# EAGLE design 18066^0 (EAGLE 7.6.0)
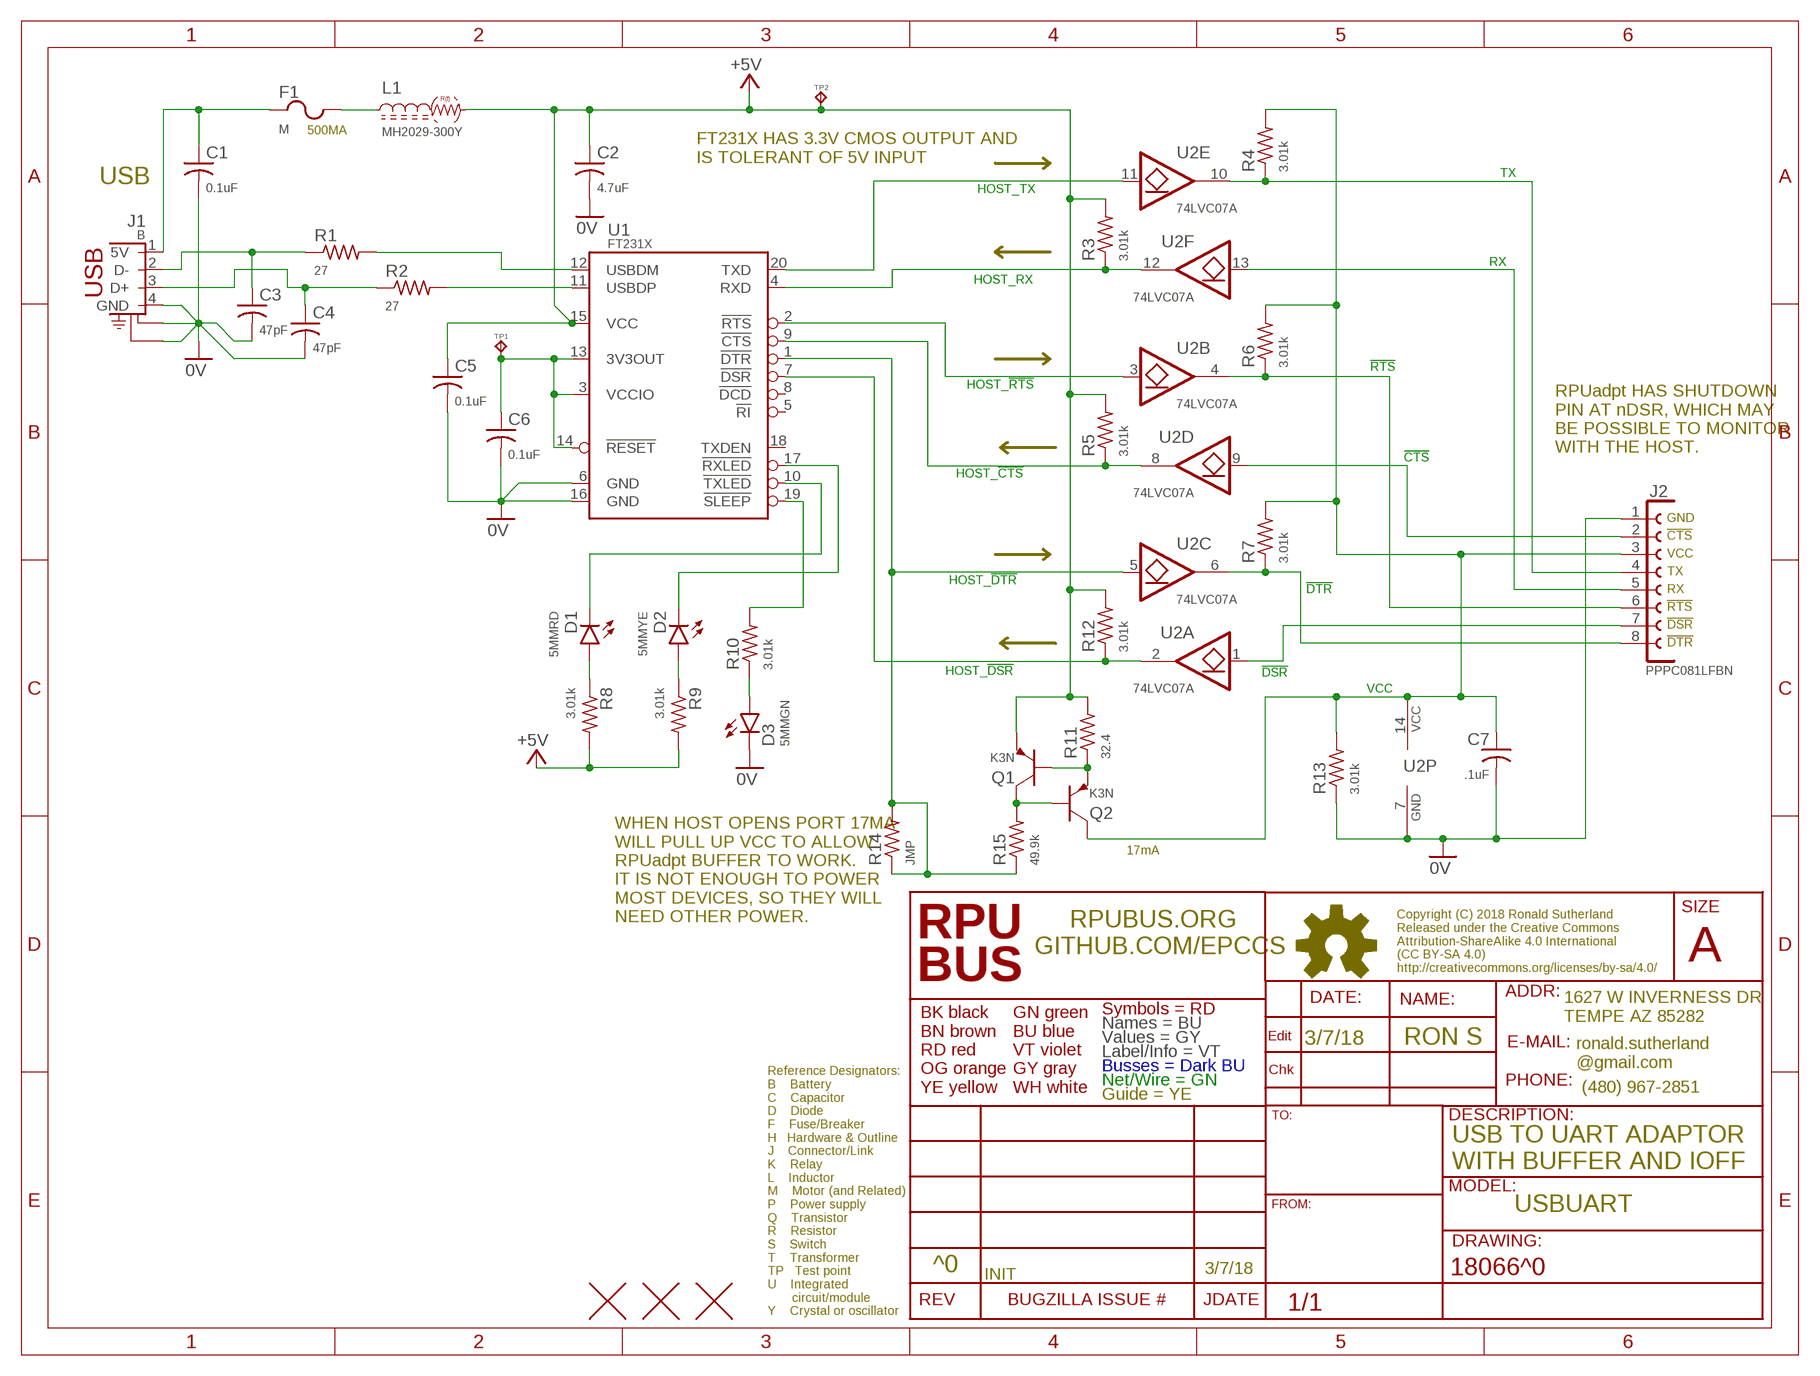
[diagram p0: schematic, sheet 1]

## Parts
C1  0.1uF  CC0603A  [C0603(1608)]
C2  4.7uF  CC1206  [C1206(3216)]
C3  47pF  CC0603A  [C0603(1608)]
C4  47pF  CC0603A  [C0603(1608)]
C5  0.1uF  CC0603A  [C0603(1608)]
C6  0.1uF  CC0603A  [C0603(1608)]
C7  .1uF  CC0603A  [C0603(1608)]
D1  5MMRD  LED5MM  [LED5MM]
D2  5MMYE  LED5MM  [LED5MM]
D3  5MMGN  LED5MM  [LED5MM]
F1  M  SMD1210  [C1210(3225)]
J1  B  [USB-B-PTH]
J2  PPPC081LFBN  F1X8  [F1X8]
L1  MH2029-300Y  L0805  [C0805(2012)]
Q1  K3N  PNPSOT23  [SOT23]
Q2  K3N  PNPSOT23  [SOT23]
R1  27  R0805  [C0805(2012)]
R2  27  R0805  [C0805(2012)]
R3  3.01k  R0805  [C0805(2012)]
R4  3.01k  R0805  [C0805(2012)]
R5  3.01k  R0805  [C0805(2012)]
R6  3.01k  R0805  [C0805(2012)]
R7  3.01k  R0805  [C0805(2012)]
R8  3.01k  R0805  [C0805(2012)]
R9  3.01k  R0805  [C0805(2012)]
R10  3.01k  R0805  [C0805(2012)]
R11  32.4  R0805  [C0805(2012)]
R12  3.01k  R0805  [C0805(2012)]
R13  3.01k  R0805  [C0805(2012)]
R14  JMP  R0805  [C0805(2012)]
R15  49.9k  R0805  [C0805(2012)]
TP1  TPPAD1-08  [P1-08]
TP2  TPPAD1-08  [P1-08]
U1  FT231X  [20SSOP]
U2  74LVC07A  7407D  [14SOIC]
U$2  FIDUCIAL1.27  [FIDUCIAL-1.27]
U$3  FIDUCIAL1.27  [FIDUCIAL-1.27]
U$4  FIDUCIAL1.27  [FIDUCIAL-1.27]

## Nets
0V: C1.2 C2.2 C3.2 C4.2 C5.2 C6.2 C7.2 D3.K J1.4(GND) J1.S1(CHASSIS1) J1.S2(CHASSIS2) J2.1 R13.1 U1.6(GND) U1.16(GND) U2.7(P:GND)
!CTS: J2.2 U2.9(D:I)
!DSR: J2.7 U2.1(A:I)
!DTR: J2.8 R7.1 U2.6(C:O)
!RTS: J2.6 R6.1 U2.4(B:O)
+5V: C2.1 C5.1 L1.2 Q1.E R3.2 R5.2 R8.2 R9.2 R11.2 R12.2 TP2.TP U1.15(VCC)
D+: C4.1 J1.3(D+) R2.1
D-: C3.1 J1.2(D-) R1.1
FT3V3: C6.1 TP1.TP U1.3(VCCIO) U1.13(3V3OUT) U1.14(!RESET!)
HOST_!CTS: R5.1 U1.9(!CTS!) U2.8(D:O)
HOST_!DSR: R12.1 U1.7(!DSR!) U2.2(A:O)
HOST_!DTR: R14.1 R14.2 R15.1 U1.1(!DTR!) U2.5(C:I)
HOST_!RTS: U1.2(!RTS!) U2.3(B:I)
HOST_RX: R3.1 U1.4(RXD) U2.12(F:O)
HOST_TX: U1.20(TXD) U2.11(E:I)
N$3: Q1.B Q2.E R11.1
N$4: C1.1 F1.1 J1.1(5V)
N$5: F1.2 L1.1
N$6: D2.A R9.1
N$7: D1.K U1.10(!TXLED)
N$8: D2.K U1.17(!RXLED)
N$9: Q1.C Q2.B R15.2
N$12: R1.2 U1.12(USBDM)
N$13: R2.2 U1.11(USBDP)
N$14: D3.A R10.1
N$16: D1.A R8.1
N$18: R10.2 U1.19(!SLEEP)
RX: J2.5 U2.13(F:I)
TX: J2.4 R4.1 U2.10(E:O)
VCC: C7.1 J2.3 Q2.C R4.2 R6.2 R7.2 R13.2 U2.14(P:VCC)
Unconnected: U1.5(!RI!) U1.8(!DCD!) U1.18(TXDEN)

## Notes on the sheet
- 500MA
- FT231X HAS 3.3V CMOS OUTPUT AND
  IS TOLERANT OF 5V INPUT
- USB
- RPUadpt HAS SHUTDOWN 
  PIN AT nDSR, WHICH MAY 
  BE POSSIBLE TO MONITOR
  WITH THE HOST.
- GND
- !CTS
- VCC
- TX
- RX
- !RTS
- !DSR
- !DTR
- 17mA
- WHEN HOST OPENS PORT 17MA
  WILL PULL UP VCC TO ALLOW 
  RPUadpt BUFFER TO WORK.
  IT IS NOT ENOUGH TO POWER 
  MOST DEVICES, SO THEY WILL 
  NEED OTHER POWER.
- 3/7/18 | RON S
- USB TO UART ADAPTOR 
  WITH BUFFER AND IOFF
- USBUART
- ^0 | 3/7/18
- INIT

## Library data of the parts
C1-C7 = C-C:C: CAPACITOR Symbol
D1-D3 = D-LED:LED: LED 120120WH [CREE,XHGAWT-00-0000-00000HXE1] LED WHITE 6500K 150LUM-W120120
F1 = F-RST:SMD: Fuse i.e. Bourns, MF-USMF075-2
J1 = J-USB:B: B [MOLEX,0670688000] USB B THROUGH HOLE
J2 = J-HDR2.54mm:F1X8: FEMALE HEADER 8POS
L1 = L-FB:L: Ferrite Bead with frequency dependent resistance
Q1 Q2 = Q-PNP:PNP: BJT NPN General Purpose Amplifier
R1-R15 = R-C:R: Resiistor American-style symbol
TP1 TP2 = J-TP:TP: Test pad
U1 = U-Transceiver:FT231X
U2 = U-7400:74*07: HEX BUFFER, OPEN DRAIN/COLLECTOR 74LVC07A [DIODES,74LVC07AS14-13] LOGIC BUFFER OPEN DRAIN 14SOIC
U$2-U$4 = H-Fiducial:FIDUCIAL: Fiducial Alignment Points Various fiducial points for machine vision alignment.

## Net classes
0 default: width 0.178 mm, drill 0.33 mm

## Board
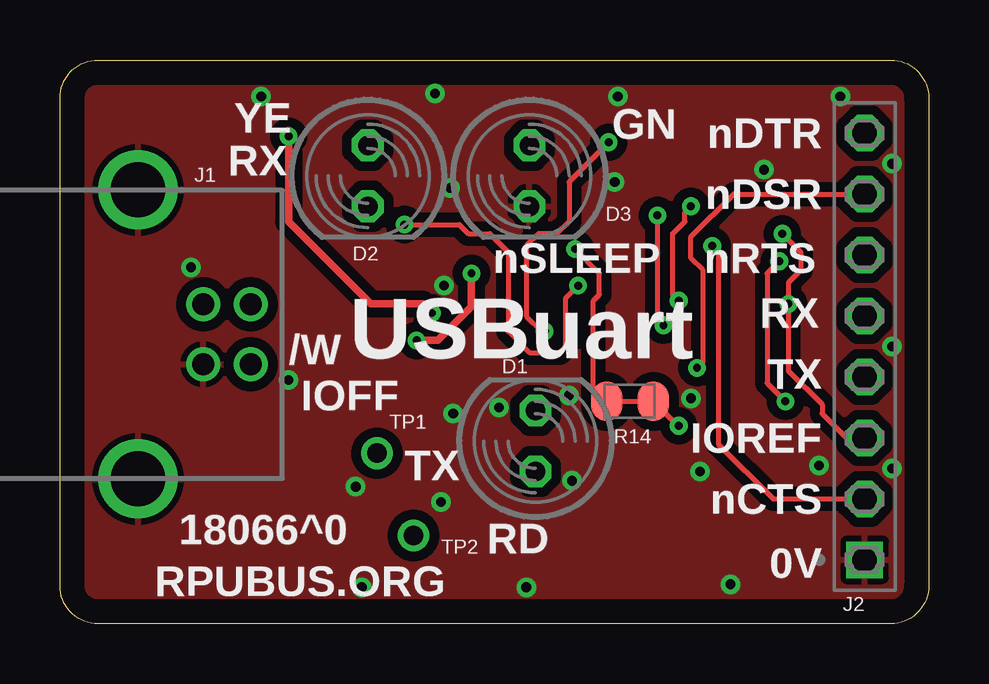
[diagram p1: board, top side]
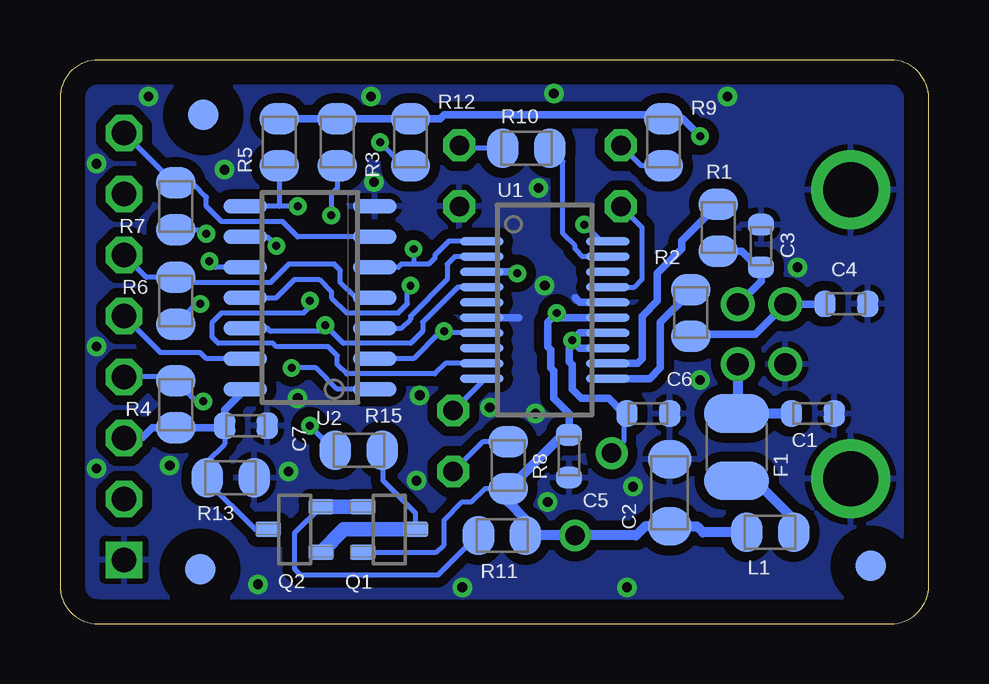
[diagram p2: board, bottom side, seen from below]

Size 36.2 x 23.5 mm. Coordinates in mm from the lower left corner, seen from the top.
Outline: 36.2,21.91 36.2,1.59 arc-90 34.61,0 1.59,0 arc-90 0,1.59 0,21.91 arc-90 1.59,23.5 34.61,23.5 arc-90 36.2,21.91
Copper layers (1*16): Top 0.034290625mm / dielectric 60mil / Bottom 0.034290625mm
Design rules "default *": minimum track width 10mil, minimum drill 13mil, track to track 8mil, track to pad 8mil, pad to pad 8mil, via to via 8mil, smd to smd 8mil, copper to edge 40mil, drill to drill 12mil, minimum pad ring 10mil, minimum via ring 8mil, stop-mask expansion 4mil, vias tented up to drill 17mil, thermal gap 10mil

### Footprints (pad centres in the part's own frame; a part is rotated, then mirrored left to right if it is on the bottom)
C0603(1608) = smd 0.898 x 1.1: 1 -0.889,0; 2 0.889,0
C1206(3216) = smd 1.6 x 1.8: 1 -1.4,0; 2 1.4,0
LED5MM = drill 0.813 octagon: A -1.27,0; K 1.27,0
C1210(3225) = smd 1.6 x 2.7: 1 -1.4,0; 2 1.4,0
USB-B-PTH = drill 0.914: 1 1.981,-1.25; 2 1.981,1.25; 3 0,1.25; 4 0,-1.25 | drill 2.286: S1 -2.718,-6.02; S2 -2.718,6.02
F1X8 = drill 1.016 square: 1 0,0 | drill 1.016 octagon: 2 2.54,0; 3 5.08,0; 4 7.62,0; 5 10.16,0; 6 12.7,0; 7 15.24,0; 8 17.78,0
C0805(2012) = smd 1.321 x 1.651: 1 -0.977,0; 2 0.977,0
SOT23 = smd 0.65 x 1.06: B -0.95,-1.1; C 0,1.1; E 0.95,-1.1
P1-08 = drill 0.813: TP 0,0
20SSOP = smd 0.33 x 1.8: 1 -2.857,-2.625; 2 -2.223,-2.625; 3 -1.587,-2.625; 4 -0.953,-2.625; 5 -0.318,-2.625; 6 0.318,-2.625; 7 0.953,-2.625; 8 1.587,-2.625; 9 2.223,-2.625; 10 2.857,-2.625; 11 2.857,2.625; 12 2.223,2.625; 13 1.587,2.625; 14 0.953,2.625; 15 0.318,2.625; 16 -0.318,2.625; 17 -0.953,2.625; 18 -1.587,2.625; 19 -2.223,2.625; 20 -2.857,2.625
14SOIC = smd 0.6 x 1.8: 1 -3.81,-2.7; 2 -2.54,-2.7; 3 -1.27,-2.7; 4 0,-2.7; 5 1.27,-2.7; 6 2.54,-2.7; 7 3.81,-2.7; 8 3.81,2.7; 9 2.54,2.7; 10 1.27,2.7; 11 0,2.7; 12 -1.27,2.7; 13 -2.54,2.7; 14 -3.81,2.7
FIDUCIAL-1.27 = smd 1.27 x 1.27: 1 0,0

### Placement (x,y rotation side)
C1  4.83,8.76 0 bottom
C2  10.79,5.46 90 bottom
C3  6.99,15.75 90 bottom
C4  3.43,13.34 0 bottom
C5  14.99,6.99 270 bottom
C6  11.68,8.76 0 bottom
C7  28.45,8.26 0 bottom
D1  19.81,7.62 90 top
D2  12.83,18.67 270 top
D3  19.56,18.67 270 top
F1  8,7.37 270 bottom
J1  5.97,12.06 0 top
J2  33.53,2.67 90 top
L1  6.6,3.81 180 bottom
Q1  22.48,3.94 270 bottom
Q2  26.42,3.94 90 bottom
R1  8.76,16.51 90 bottom
R2  9.91,12.95 90 bottom
R3  24.64,20.07 90 bottom
R4  31.37,9.14 270 bottom
R5  27.05,20.07 90 bottom
R6  31.37,13.46 270 bottom
R7  31.37,17.4 270 bottom
R8  17.53,6.6 270 bottom
R9  11.05,20.07 90 bottom
R10  16.76,19.81 0 bottom
R11  17.78,3.68 0 bottom
R12  21.59,20.07 90 bottom
R13  29.08,6.1 180 bottom
R14  23.75,9.27 180 top
R15  23.75,7.24 0 bottom
TP1  13.21,7.11 0 top
TP2  14.73,3.68 0 top
U1  16,13.08 270 bottom
U2  25.78,13.59 90 bottom
U$2  30.23,21.21 0 bottom
U$3  2.41,2.41 0 bottom
U$4  30.35,2.29 0 bottom

### Tracks (layer width: path | path; a pad name or v marks a point on that pad's centre or on a via)
0V  (via drill 0.41)
  Bottom 0.305: U1.16 14.54,13.4 14.73,13.59 | U1.6 17.08,12.76
  other vias: 26.67,6.35 26.29,9.4 23.11,18.41 29.34,18.92 34.67,19.18 34.67,11.56 34.67,6.48 21.34,5.97 21.21,9.53 18.29,9.02 16.38,8.76 16,14.1 16.26,18.16 23.24,21.97 15.62,22.1 8.38,21.97 5.46,14.86 12.57,1.52 19.43,1.52 27.94,1.65 15.88,5.08 12.32,5.71 9.53,10.16 31.62,6.6 32.51,21.97
  pour Top (isolate 0.406): 36.2,0 0,0 0,23.5 36.2,23.5
  pour Bottom (isolate 0.406): 0,23.5 36.2,23.5 36.2,0 0,0
!CTS  (via drill 0.33)
  Top 0.203: v27.18,15.75 27.43,15.49 27.43,7.49 29.72,5.21 J2.2
  Bottom 0.203: U2.9 27.56,16.13 v27.18,15.75
!DSR  (via drill 0.33)
  Top 0.203: v26.54,10.67 26.8,10.92 26.8,14.73 26.29,15.24 26.29,16.13 28.07,17.91 J2.7
  Bottom 0.203: U2.1 24.64,9.78 25.53,10.67 v26.54,10.67
!DTR
  Bottom 0.203: U2.6 26.29,16.13 26.92,16.76 29.46,16.76 30.1,17.4 30.1,17.78 30.61,18.29 R7.1 31.46,18.38 J2.8
!RTS
  Bottom 0.203: U2.4 23.88,13.59 24.51,14.22 24.51,14.73 24.77,14.99 26.67,14.99 27.43,14.22 31.15,14.22 R6.1 32.6,14.44 J2.6
+5V  (via drill 0.33)
  Top 0.305: v9.53,20.32 9.53,16.76 12.95,13.34 15.11,13.34 v15.49,12.95
  Bottom 0.203: Q1.E 20.51,2.99 20.19,3.3 20.19,4.32 19.43,5.08 19.05,5.08 18.5,5.63 R8.2
  Bottom 0.305: C5.1 14.99,8.76 15.62,9.4 15.62,10.54 15.75,10.67 15.75,11.43 15.88,11.56 15.88,12.57 v15.49,12.95 15.3,12.76 U1.15 | v9.53,20.32 10.25,21.04 R9.2 11.21,21.21 20.19,21.21 20.36,21.04 R12.2 R3.2 R5.2
  Bottom 0.406: L1.2 9.4,3.81 9.65,4.06 C2.1 11.81,4.06 12.19,3.68 TP2.TP R11.2 16.8,4.36 17.53,5.08 R8.2 17.49,5.63 15.24,7.87 C5.1
D+
  Bottom 0.305: C4.1 4.34,13.31 J1.3 7.22,12.06 9.82,12.06 R2.1
D-
  Bottom 0.305: 8.06,13.21 J1.2 6.99,14.28 C3.1 7.11,14.86 7.79,15.53 R1.1
FT3V3  (via drill 0.33)
  Top 0.305: v17.14,14.61 17.14,13.21 15.75,11.81 v14.86,11.81
  Bottom 0.203: 12.7,8.76 12.7,7.62 TP1.TP
  Bottom 0.305: U1.3 17.21,14.67 v17.14,14.61 | v14.86,11.81 14.61,11.56 | U1.13 14.54,11.49 v14.86,11.81 | U1.14 14.54,12.13 v14.86,11.81 | C6.1 12.7,8.76 13.34,9.4 14.48,9.4 14.86,9.78 14.86,10.79 14.99,10.92 14.99,11.68 v14.86,11.81
HOST_!CTS  (via drill 0.33)
  Top 0.203: v25.78,13.46 25.53,13.72 25.53,16.26 26.04,16.76 26.04,17.14 v26.29,17.4
  Bottom 0.203: U1.9 20.13,10.86 20.57,10.41 24.26,10.41 24.64,10.79 24.64,11.18 25.02,11.56 27.18,11.56 27.3,11.68 29.59,11.68 29.84,11.94 29.84,12.57 29.46,12.95 26.04,12.95 25.78,13.21 v25.78,13.46 | v26.29,17.4 27.05,17.4 | 27.05,17.4 U2.8 | R5.1 27.05,17.4
HOST_!DSR  (via drill 0.33)
  Top 0.203: v22.86,20.07 21.21,18.41 21.21,16.76 20.7,16.26 19.94,16.26 19.43,15.75 19.43,12.83 20.07,12.19 v20.19,12.19
  Bottom 0.203: U2.2 21.46,11.05 20.38,12.13 20.19,12.13 | U1.7 20.19,12.13 | R12.1 21.88,19.09 v22.86,20.07 | v20.19,12.19 20.19,12.13
HOST_!DTR  (via drill 0.33)
  Top 0.203: v21.46,15.62 22.48,14.61 22.48,13.72 22.23,13.46 22.23,9.78 22.26,9.78 R14.2 R14.1 25.74,8.26 v25.78,8.26
  Bottom 0.203: U1.1 20,15.94 20.57,15.37 20.57,15.24 20.83,14.99 21.46,14.99 | 21.46,14.99 21.97,14.99 22.1,14.86 U2.5 | R15.1 24.77,7.24 v25.78,8.26 | v21.46,15.62 21.46,14.99
HOST_!RTS
  Bottom 0.203: U1.2 19.75,15.3 20.07,14.99 20.07,14.35 21.59,12.83 21.59,12.7 21.97,12.32 U2.3
HOST_RX  (via drill 0.33)
  Top 0.203: v24.89,17.02 24.89,12.95 25.15,12.7 v25.15,12.45
  Bottom 0.203: U1.4 19.62,14.03 21.08,12.57 21.08,12.19 21.59,11.68 24.38,11.68 24.89,12.19 25.15,12.19 | 25.15,12.19 27.43,12.19 27.56,12.32 U2.12 | R3.1 24.64,18.16 24.89,17.91 v24.89,17.02 | v25.15,12.45 25.15,12.19
HOST_TX  (via drill 0.33)
  Top 0.203: v14.35,16.64 16.64,16.64 17.02,16.26 17.91,16.26 18.67,15.49 18.67,12.19 19.56,11.3 20.83,11.3 21.08,11.56 21.08,13.59 v21.59,14.1
  Bottom 0.203: U1.20 13.65,15.94 v14.35,16.64 | U2.11 27.18,13.59 26.42,14.35 25.4,14.35 24.89,13.84 24.89,13.59 24.26,12.95 22.1,12.95 21.72,13.34 21.72,13.97 v21.59,14.1
N$3
  Bottom 0.203: R11.1 18.8,3.68 20.45,2.03 26.16,2.03 26.42,2.29 26.42,3.79 Q2.E
  Bottom 0.61: Q2.E Q1.B
N$4
  Bottom 0.406: J1.1 7.95,8.82 F1.1 C1.1
N$5
  Bottom 0.406: F1.2 7.24,5.97 5.63,4.36 L1.1
N$6
  Bottom 0.203: R9.1 11.98,19.09 D2.A
N$7
  Bottom 0.203: U1.10 18.63,10.07 D1.K
N$8
  Bottom 0.203: U1.17 12.26,14.03 11.94,14.35 11.94,16.51 D2.K
N$9
  Bottom 0.203: Q1.C 21.38,4.62 22.73,5.97 22.73,7.2 R15.2
  Bottom 0.61: Q1.C 24.37,3.94 Q2.B
N$12
  Bottom 0.305: U1.12 12.13,10.86 11.94,11.05 11.94,12.83 11.3,13.46 11.3,14.61 10.29,15.62 10.29,15.96 R1.2
N$13
  Bottom 0.305: R2.2 9.95,13.8 11.18,12.57 11.18,10.67 11.62,10.22 U1.11
N$14
  Bottom 0.203: R10.1 19.43,19.81 D3.A
N$16
  Bottom 0.203: R8.1 18.58,7.58 D1.A
N$18
  Bottom 0.203: U1.19 14.41,15.3 14.73,15.62 14.73,15.75 15.24,16.26 15.24,19.27 R10.2
RX
  Bottom 0.203: U2.13 30.1,11.05 30.35,11.3 32,11.3 J2.5
TX  (via drill 0.33)
  Top 0.203: v29.97,15.11 29.46,14.61 29.46,10.03 v30.23,9.27
  Bottom 0.203: U2.10 29.72,14.86 v29.97,15.11 | v30.23,9.27 30.52,9.27 R4.1 31.54,10.29 J2.4
VCC  (via drill 0.33)
  Top 0.203: v30.1,16.26 30.86,15.49 30.86,14.73 30.35,14.22 v30.35,13.34 30.35,10.54 31.75,9.14 31.75,8.76 32.77,7.75 J2.3
  Bottom 0.203: Q2.C 28.07,3.94 30.06,5.93 R13.2 30.06,6.77 29.34,7.49 C7.1 | R7.2 30.27,16.42 v30.1,16.26 | v30.35,13.34 30.52,13.34 R6.2
  Bottom 0.305: J2.3 32.77,7.75 32.35,8.17 R4.2 29.43,8.17 C7.1 | C7.1 29.34,8.92 U2.14 | C7.1 29.34,8

### Text on the board
tPlace: nDTR | YE | GN | RX | nDSR | nRTS | nSLEEP | RX | USBuart | TX | /W / IOFF | IOREF | TX | nCTS | 18066^0 | RD | 0V | RPUBUS.ORG